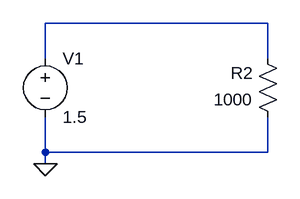
[diagram p0: schematic Lab2_2A_1000.asc]
Lab2_2A_1000.asc, the LTspice schematic file:
Version 4
SHEET 1 880 680
WIRE 352 80 48 80
WIRE 48 128 48 80
WIRE 352 128 352 80
WIRE 48 256 48 208
WIRE 352 256 352 208
WIRE 352 256 48 256
WIRE 48 272 48 256
FLAG 48 272 0
SYMBOL voltage 48 112 R0
WINDOW 123 0 0 Left 0
WINDOW 39 0 0 Left 0
SYMATTR InstName V1
SYMATTR Value 1.5
SYMBOL res 368 224 R180
WINDOW 0 36 76 Left 2
WINDOW 3 36 40 Left 2
SYMATTR InstName R2
SYMATTR Value 1000

The netlist it stands for:
* Lab2_2A_1000.asc
V1 N001 0 1.5
R2 0 N001 1000
.backanno
.end